# Altium schematic sheet XX_DDR3.SchDoc
size 594 x 420 mm; PageSetup: Record=PageOptions|CenterHorizontal=False|CenterVertical=False|PrintScale=0.95|XCorrection=0.00|YCorrection=0.00|PrintKind=1|BorderSize=5000000|LeftOffset=0|BottomOffset=0|Orientation=1|PaperLength=1000|PaperWidth=1000|Scale=100|PaperSource=15|PrintQuality=600|MediaType=1|DitherType=10|PaperKind=A4|PrintScaleMode=1; ESKD_Decimal_Number: {XXXX.XXXXXX.XXX}; Address1: Address1; Address2: Address2; Address3: Address3; Address4: Address4; DocumentNumber: АБВГ.123456.001 Э3; SheetNumber: 2; SheetTotal: 5; Scale: 1:1; DocumentType: Схема электрическая принципиальная; FirstReferrence: АБВГ.123456.001
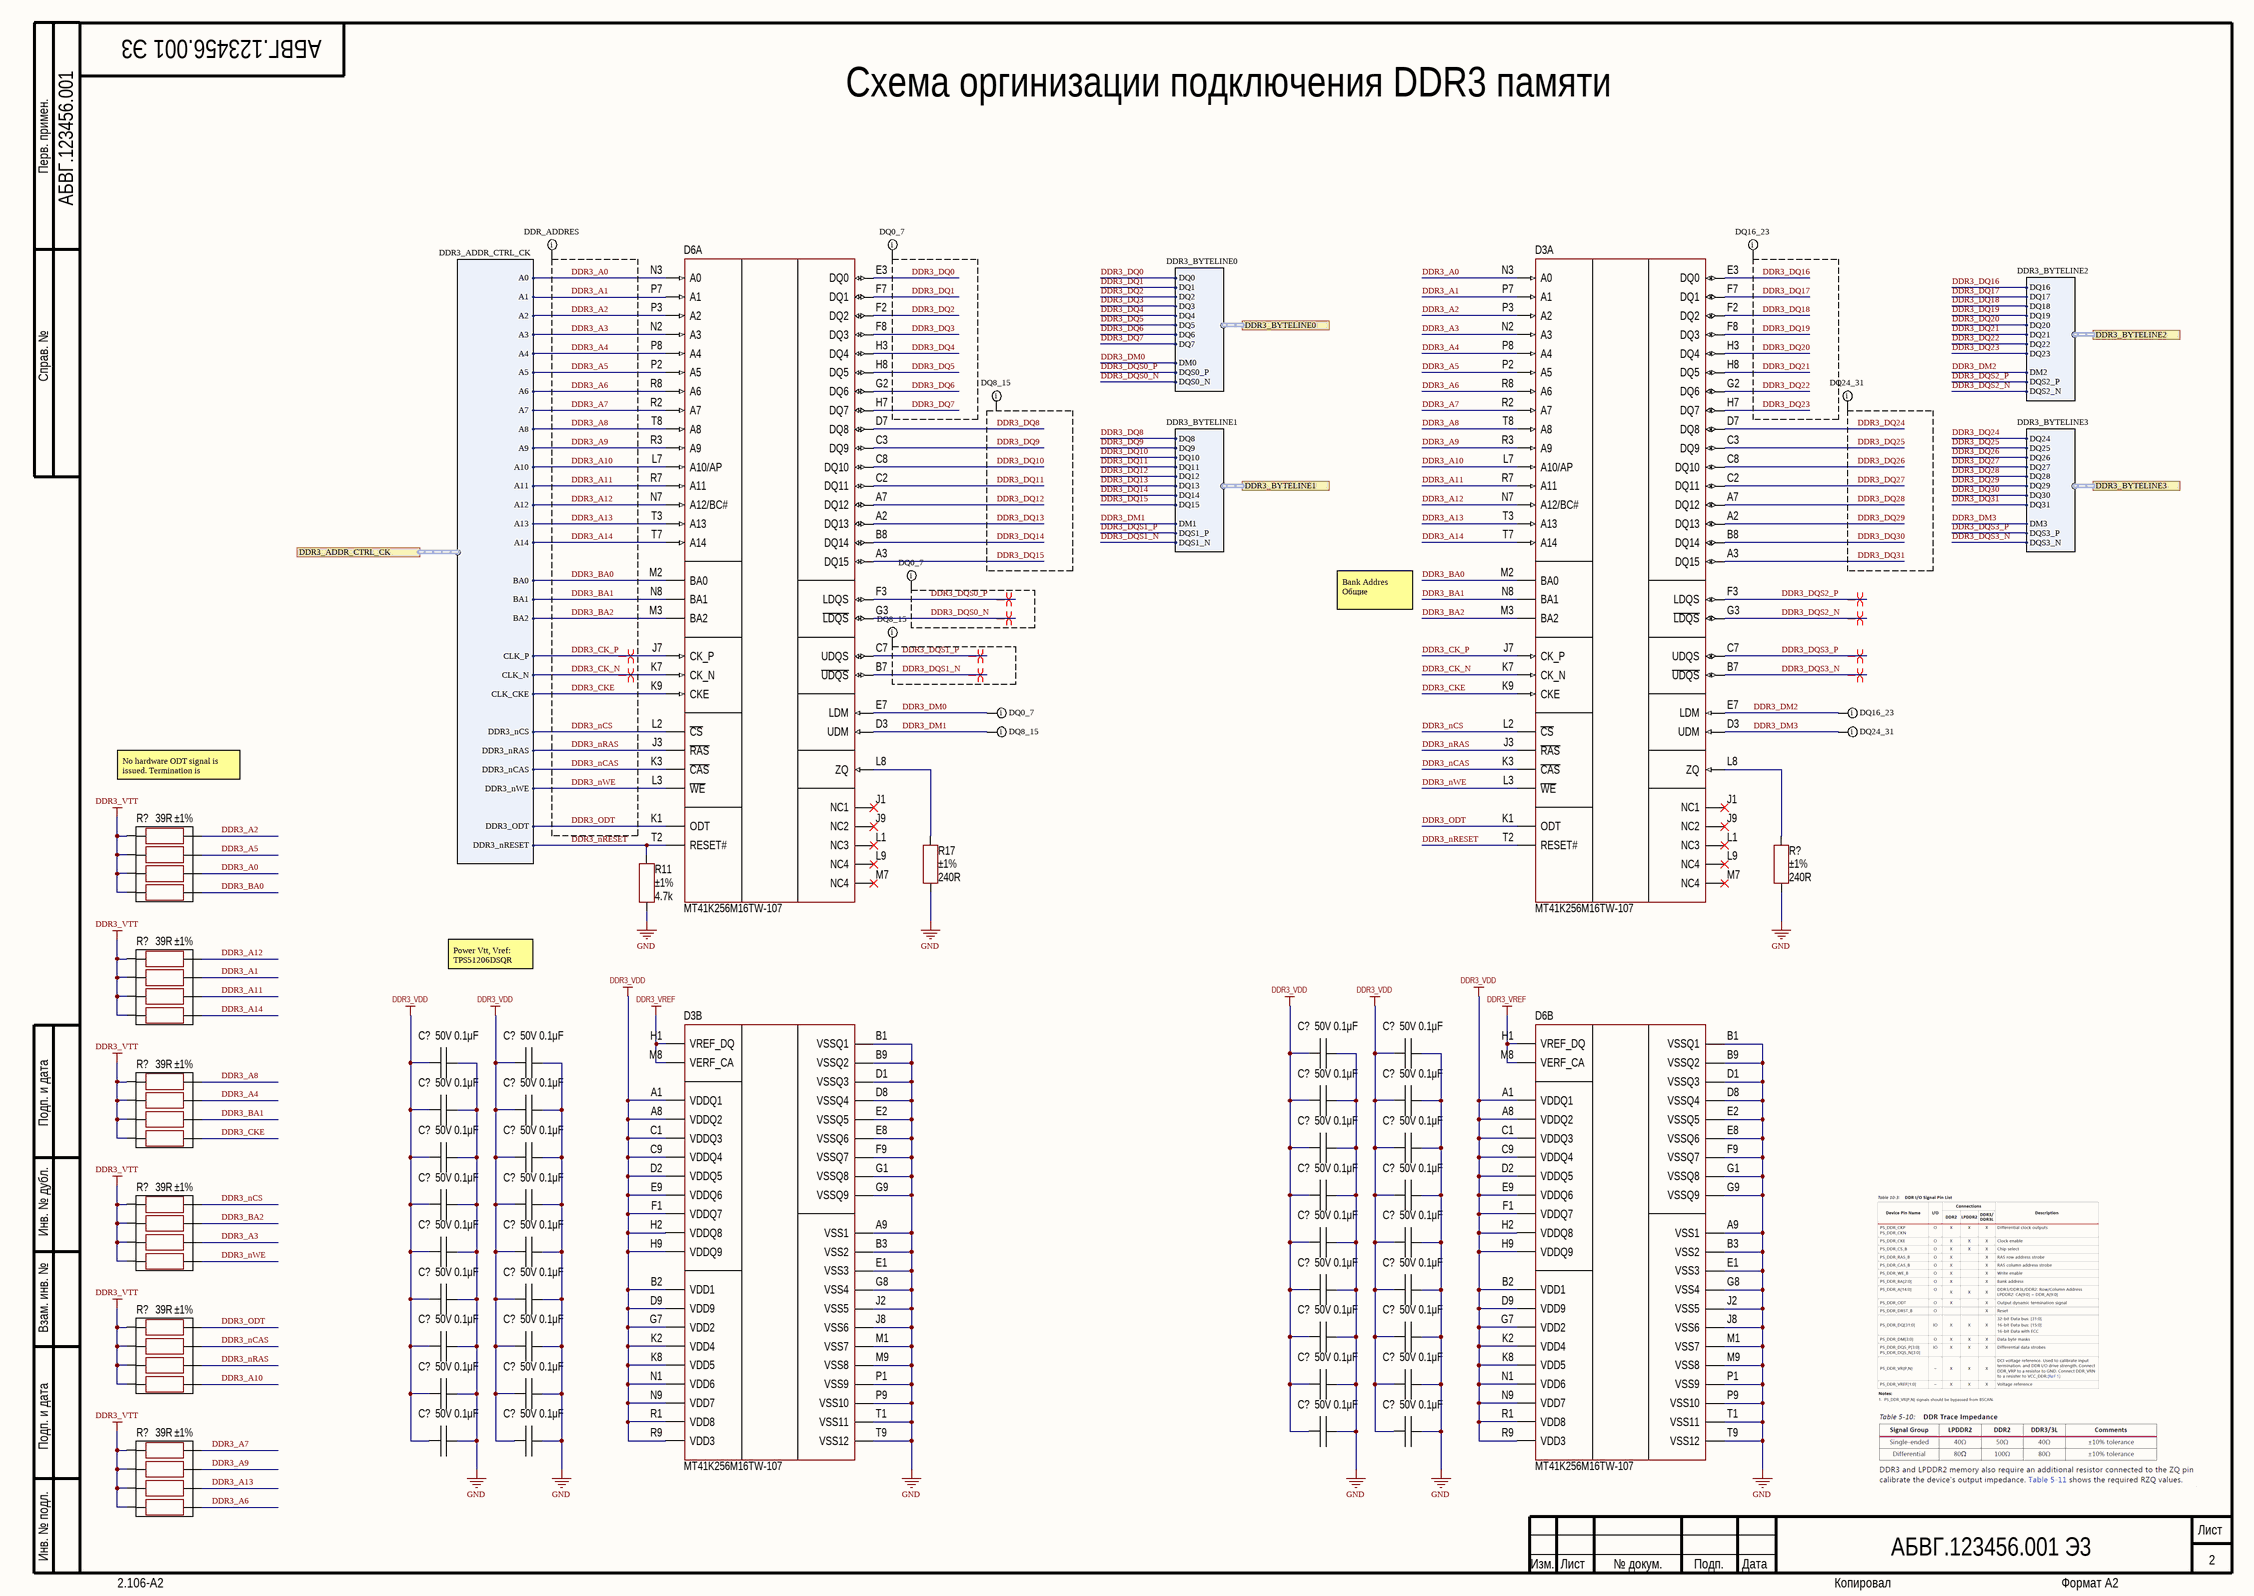
[diagram p0: XX_DDR3.SchDoc]

## Parts
(Parts that share a designator on the sheet are numbered #1, #2 ... from top to bottom, then left to right.)
C?#1  value 0.1μF  Voltage: 50V  [CAP: 0402]
C?#2  value 0.1μF  Voltage: 50V  [CAP: 0402]
C?#3  value 0.1μF  Voltage: 50V  [CAP: 0402]
C?#4  value 0.1μF  Voltage: 50V  [CAP: 0402]
C?#5  value 0.1μF  Voltage: 50V  [CAP: 0402]
C?#6  value 0.1μF  Voltage: 50V  [CAP: 0402]
C?#7  value 0.1μF  Voltage: 50V  [CAP: 0402]
C?#8  value 0.1μF  Voltage: 50V  [CAP: 0402]
C?#9  value 0.1μF  Voltage: 50V  [CAP: 0402]
C?#10  value 0.1μF  Voltage: 50V  [CAP: 0402]
C?#11  value 0.1μF  Voltage: 50V  [CAP: 0402]
C?#12  value 0.1μF  Voltage: 50V  [CAP: 0402]
C?#13  value 0.1μF  Voltage: 50V  [CAP: 0402]
C?#14  value 0.1μF  Voltage: 50V  [CAP: 0402]
C?#15  value 0.1μF  Voltage: 50V  [CAP: 0402]
C?#16  value 0.1μF  Voltage: 50V  [CAP: 0402]
C?#17  value 0.1μF  Voltage: 50V  [CAP: 0402]
C?#18  value 0.1μF  Voltage: 50V  [CAP: 0402]
C?#19  value 0.1μF  Voltage: 50V  [CAP: 0402]
C?#20  value 0.1μF  Voltage: 50V  [CAP: 0402]
C?#21  value 0.1μF  Voltage: 50V  [CAP: 0402]
C?#22  value 0.1μF  Voltage: 50V  [CAP: 0402]
C?#23  value 0.1μF  Voltage: 50V  [CAP: 0402]
C?#24  value 0.1μF  Voltage: 50V  [CAP: 0402]
C?#25  value 0.1μF  Voltage: 50V  [CAP: 0402]
C?#26  value 0.1μF  Voltage: 50V  [CAP: 0402]
C?#27  value 0.1μF  Voltage: 50V  [CAP: 0402]
C?#28  value 0.1μF  Voltage: 50V  [CAP: 0402]
C?#29  value 0.1μF  Voltage: 50V  [CAP: 0402]
C?#30  value 0.1μF  Voltage: 50V  [CAP: 0402]
C?#31  value 0.1μF  Voltage: 50V  [CAP: 0402]
C?#32  value 0.1μF  Voltage: 50V  [CAP: 0402]
C?#33  value 0.1μF  Voltage: 50V  [CAP: 0402]
C?#34  value 0.1μF  Voltage: 50V  [CAP: 0402]
C?#35  value 0.1μF  Voltage: 50V  [CAP: 0402]
C?#36  value 0.1μF  Voltage: 50V  [CAP: 0402]
D3  (no value)  [IC: FBGA96]  (parts A,B of 2)
D6  (no value)  [IC: FBGA96]  (parts A,B of 2)
R11  value 4.7k  Tolerance: ±1%  [RES: 0402]
R17  value 240R  Tolerance: ±1%  [RES: 0402]
R?#1  value 39R  Tolerance: ±1%
R?#2  value 240R  Tolerance: ±1%  [RES: 0402]
R?#3  value 39R  Tolerance: ±1%
R?#4  value 39R  Tolerance: ±1%
R?#5  value 39R  Tolerance: ±1%
R?#6  value 39R  Tolerance: ±1%
R?#7  value 39R  Tolerance: ±1%

## Ports
DDR3_ADDR_CTRL_CK (harness DDR3_ADDR_CTRL_CK), DDR3_BYTELINE0 (harness DDR3_BYTELINE0), DDR3_BYTELINE1 (harness DDR3_BYTELINE1), DDR3_BYTELINE2 (harness DDR3_BYTELINE2), DDR3_BYTELINE3 (harness DDR3_BYTELINE3)

## Harnesses
DDR3_BYTELINE0: DQ0, DQ1, DQ2, DQ3, DQ4, DQ5, DQ6, DQ7, DM0, DQS0_P, DQS0_N
DDR3_BYTELINE1: DQ8, DQ9, DQ10, DQ11, DQ12, DQ13, DQ14, DQ15, DM1, DQS1_P, DQS1_N
DDR3_BYTELINE2: DQ16, DQ17, DQ18, DQ19, DQ20, DQ21, DQ22, DQ23, DM2, DQS2_P, DQS2_N
DDR3_BYTELINE3: DQ24, DQ25, DQ26, DQ27, DQ28, DQ29, DQ30, DQ31, DM3, DQS3_P, DQS3_N
DDR3_ADDR_CTRL_CK: A0, A1, A2, A3, A4, A5, A6, A7, A8, A9, A10, A11, A12, A13, A14, BA0, BA1, BA2, CLK_P, CLK_N, CLK_CKE, DDR3_nCS, DDR3_nRAS, DDR3_nWE, DDR3_nCAS, DDR3_ODT, DDR3_nRESET

## Nets
DDR3_VDD: C?#1.2 C?#2.2 C?#3.2 C?#4.2 C?#5.2 C?#6.2 C?#7.2 C?#8.2 C?#9.2 C?#10.2 C?#11.2 C?#12.2 C?#13.2 C?#14.2 C?#15.2 C?#16.2 C?#17.2 C?#18.2 C?#19.2 C?#20.2 C?#21.2 C?#22.2 C?#23.2 C?#24.2 C?#25.2 C?#26.2 C?#27.2 C?#28.2 C?#29.2 C?#30.2 C?#31.2 C?#32.2 C?#33.2 C?#34.2 C?#35.2 C?#36.2 D3.A1(VDDQ1) D3.A8(VDDQ2) D3.B2(VDD1) D3.C1(VDDQ3) D3.C9(VDDQ4) D3.D2(VDDQ5) D3.D9(VDD9) D3.E9(VDDQ6) D3.F1(VDDQ7) D3.G7(VDD2) D3.H2(VDDQ8) D3.H9(VDDQ9) D3.K2(VDD4) D3.K8(VDD5) D3.N1(VDD6) D3.N9(VDD7) D3.R1(VDD8) D3.R9(VDD3) D6.A1(VDDQ1) D6.A8(VDDQ2) D6.B2(VDD1) D6.C1(VDDQ3) D6.C9(VDDQ4) D6.D2(VDDQ5) D6.D9(VDD9) D6.E9(VDDQ6) D6.F1(VDDQ7) D6.G7(VDD2) D6.H2(VDDQ8) D6.H9(VDDQ9) D6.K2(VDD4) D6.K8(VDD5) D6.N1(VDD6) D6.N9(VDD7) D6.R1(VDD8) D6.R9(VDD3)
DDR3_VREF: D3.H1(VREF_DQ) D3.M8(VERF_CA) D6.H1(VREF_DQ) D6.M8(VERF_CA)
DDR3_VTT: R?#1.1 R?#1.3 R?#1.5 R?#1.7 R?#3.1 R?#3.3 R?#3.5 R?#3.7 R?#4.1 R?#4.3 R?#4.5 R?#4.7 R?#5.1 R?#5.3 R?#5.5 R?#5.7 R?#6.1 R?#6.3 R?#6.5 R?#6.7 R?#7.1 R?#7.3 R?#7.5 R?#7.7
GND: C?#1.1 C?#2.1 C?#3.1 C?#4.1 C?#5.1 C?#6.1 C?#7.1 C?#8.1 C?#9.1 C?#10.1 C?#11.1 C?#12.1 C?#13.1 C?#14.1 C?#15.1 C?#16.1 C?#17.1 C?#18.1 C?#19.1 C?#20.1 C?#21.1 C?#22.1 C?#23.1 C?#24.1 C?#25.1 C?#26.1 C?#27.1 C?#28.1 C?#29.1 C?#30.1 C?#31.1 C?#32.1 C?#33.1 C?#34.1 C?#35.1 C?#36.1 D3.A9(VSS1) D3.B1(VSSQ1) D3.B3(VSS2) D3.B9(VSSQ2) D3.D1(VSSQ3) D3.D8(VSSQ4) D3.E1(VSS3) D3.E2(VSSQ5) D3.E8(VSSQ6) D3.F9(VSSQ7) D3.G1(VSSQ8) D3.G8(VSS4) D3.G9(VSSQ9) D3.J2(VSS5) D3.J8(VSS6) D3.M1(VSS7) D3.M9(VSS8) D3.P1(VSS9) D3.P9(VSS10) D3.T1(VSS11) D3.T9(VSS12) D6.A9(VSS1) D6.B1(VSSQ1) D6.B3(VSS2) D6.B9(VSSQ2) D6.D1(VSSQ3) D6.D8(VSSQ4) D6.E1(VSS3) D6.E2(VSSQ5) D6.E8(VSSQ6) D6.F9(VSSQ7) D6.G1(VSSQ8) D6.G8(VSS4) D6.G9(VSSQ9) D6.J2(VSS5) D6.J8(VSS6) D6.M1(VSS7) D6.M9(VSS8) D6.P1(VSS9) D6.P9(VSS10) D6.T1(VSS11) D6.T9(VSS12) R11.2 R17.2 R?#2.2
DDR3_A0: D3.N3(A0) D6.N3(A0) R?#1.6 ; port DDR3_ADDR_CTRL_CK.A0
DDR3_A1: D3.P7(A1) D6.P7(A1) R?#3.4 ; port DDR3_ADDR_CTRL_CK.A1
DDR3_A2: D3.P3(A2) D6.P3(A2) R?#1.2 ; port DDR3_ADDR_CTRL_CK.A2
DDR3_A3: D3.N2(A3) D6.N2(A3) R?#5.6 ; port DDR3_ADDR_CTRL_CK.A3
DDR3_A4: D3.P8(A4) D6.P8(A4) R?#4.4 ; port DDR3_ADDR_CTRL_CK.A4
DDR3_A5: D3.P2(A5) D6.P2(A5) R?#1.4 ; port DDR3_ADDR_CTRL_CK.A5
DDR3_A6: D3.R8(A6) D6.R8(A6) R?#7.8 ; port DDR3_ADDR_CTRL_CK.A6
DDR3_A7: D3.R2(A7) D6.R2(A7) R?#7.2 ; port DDR3_ADDR_CTRL_CK.A7
DDR3_A8: D3.T8(A8) D6.T8(A8) R?#4.2 ; port DDR3_ADDR_CTRL_CK.A8
DDR3_A9: D3.R3(A9) D6.R3(A9) R?#7.4 ; port DDR3_ADDR_CTRL_CK.A9
DDR3_A10: D3.L7(A10/AP) D6.L7(A10/AP) R?#6.8 ; port DDR3_ADDR_CTRL_CK.A10
DDR3_A11: D3.R7(A11) D6.R7(A11) R?#3.6 ; port DDR3_ADDR_CTRL_CK.A11
DDR3_A12: D3.N7(A12/BC#) D6.N7(A12/BC#) R?#3.2 ; port DDR3_ADDR_CTRL_CK.A12
DDR3_A13: D3.T3(A13) D6.T3(A13) R?#7.6 ; port DDR3_ADDR_CTRL_CK.A13
DDR3_A14: D3.T7(A14) D6.T7(A14) R?#3.8 ; port DDR3_ADDR_CTRL_CK.A14
DDR3_BA0: D3.M2(BA0) D6.M2(BA0) R?#1.8 ; port DDR3_ADDR_CTRL_CK.BA0
DDR3_BA1: D3.N8(BA1) D6.N8(BA1) R?#4.6 ; port DDR3_ADDR_CTRL_CK.BA1
DDR3_BA2: D3.M3(BA2) D6.M3(BA2) R?#5.4 ; port DDR3_ADDR_CTRL_CK.BA2
DDR3_CK_N: D3.K7(CK_N) D6.K7(CK_N) ; port DDR3_ADDR_CTRL_CK.CLK_N
DDR3_CK_P: D3.J7(CK_P) D6.J7(CK_P) ; port DDR3_ADDR_CTRL_CK.CLK_P
DDR3_CKE: D3.K9(CKE) D6.K9(CKE) R?#4.8 ; port DDR3_ADDR_CTRL_CK.CLK_CKE
DDR3_DM0: D6.E7(LDM) ; port DDR3_BYTELINE0.DM0
DDR3_DM1: D6.D3(UDM) ; port DDR3_BYTELINE1.DM1
DDR3_DM2: D3.E7(LDM) ; port DDR3_BYTELINE2.DM2
DDR3_DM3: D3.D3(UDM) ; port DDR3_BYTELINE3.DM3
DDR3_DQ0: D6.E3(DQ0) ; port DDR3_BYTELINE0.DQ0
DDR3_DQ1: D6.F7(DQ1) ; port DDR3_BYTELINE0.DQ1
DDR3_DQ2: D6.F2(DQ2) ; port DDR3_BYTELINE0.DQ2
DDR3_DQ3: D6.F8(DQ3) ; port DDR3_BYTELINE0.DQ3
DDR3_DQ4: D6.H3(DQ4) ; port DDR3_BYTELINE0.DQ4
DDR3_DQ5: D6.H8(DQ5) ; port DDR3_BYTELINE0.DQ5
DDR3_DQ6: D6.G2(DQ6) ; port DDR3_BYTELINE0.DQ6
DDR3_DQ7: D6.H7(DQ7) ; port DDR3_BYTELINE0.DQ7
DDR3_DQ8: D6.D7(DQ8) ; port DDR3_BYTELINE1.DQ8
DDR3_DQ9: D6.C3(DQ9) ; port DDR3_BYTELINE1.DQ9
DDR3_DQ10: D6.C8(DQ10) ; port DDR3_BYTELINE1.DQ10
DDR3_DQ11: D6.C2(DQ11) ; port DDR3_BYTELINE1.DQ11
DDR3_DQ12: D6.A7(DQ12) ; port DDR3_BYTELINE1.DQ12
DDR3_DQ13: D6.A2(DQ13) ; port DDR3_BYTELINE1.DQ13
DDR3_DQ14: D6.B8(DQ14) ; port DDR3_BYTELINE1.DQ14
DDR3_DQ15: D6.A3(DQ15) ; port DDR3_BYTELINE1.DQ15
DDR3_DQ16: D3.E3(DQ0) ; port DDR3_BYTELINE2.DQ16
DDR3_DQ17: D3.F7(DQ1) ; port DDR3_BYTELINE2.DQ17
DDR3_DQ18: D3.F2(DQ2) ; port DDR3_BYTELINE2.DQ18
DDR3_DQ19: D3.F8(DQ3) ; port DDR3_BYTELINE2.DQ19
DDR3_DQ20: D3.H3(DQ4) ; port DDR3_BYTELINE2.DQ20
DDR3_DQ21: D3.H8(DQ5) ; port DDR3_BYTELINE2.DQ21
DDR3_DQ22: D3.G2(DQ6) ; port DDR3_BYTELINE2.DQ22
DDR3_DQ23: D3.H7(DQ7) ; port DDR3_BYTELINE2.DQ23
DDR3_DQ24: D3.D7(DQ8) ; port DDR3_BYTELINE3.DQ24
DDR3_DQ25: D3.C3(DQ9) ; port DDR3_BYTELINE3.DQ25
DDR3_DQ26: D3.C8(DQ10) ; port DDR3_BYTELINE3.DQ26
DDR3_DQ27: D3.C2(DQ11) ; port DDR3_BYTELINE3.DQ27
DDR3_DQ28: D3.A7(DQ12) ; port DDR3_BYTELINE3.DQ28
DDR3_DQ29: D3.A2(DQ13) ; port DDR3_BYTELINE3.DQ29
DDR3_DQ30: D3.B8(DQ14) ; port DDR3_BYTELINE3.DQ30
DDR3_DQ31: D3.A3(DQ15) ; port DDR3_BYTELINE3.DQ31
DDR3_DQS0_N: D6.G3(~{LDQS}) ; port DDR3_BYTELINE0.DQS0_N
DDR3_DQS0_P: D6.F3(LDQS) ; port DDR3_BYTELINE0.DQS0_P
DDR3_DQS1_N: D6.B7(~{UDQS}) ; port DDR3_BYTELINE1.DQS1_N
DDR3_DQS1_P: D6.C7(UDQS) ; port DDR3_BYTELINE1.DQS1_P
DDR3_DQS2_N: D3.G3(~{LDQS}) ; port DDR3_BYTELINE2.DQS2_N
DDR3_DQS2_P: D3.F3(LDQS) ; port DDR3_BYTELINE2.DQS2_P
DDR3_DQS3_N: D3.B7(~{UDQS}) ; port DDR3_BYTELINE3.DQS3_N
DDR3_DQS3_P: D3.C7(UDQS) ; port DDR3_BYTELINE3.DQS3_P
DDR3_nCAS: D3.K3(~{CAS}) D6.K3(~{CAS}) R?#6.4 ; port DDR3_ADDR_CTRL_CK.DDR3_nCAS
DDR3_nCS: D3.L2(~{CS}) D6.L2(~{CS}) R?#5.2 ; port DDR3_ADDR_CTRL_CK.DDR3_nCS
DDR3_nRAS: D3.J3(~{RAS}) D6.J3(~{RAS}) R?#6.6 ; port DDR3_ADDR_CTRL_CK.DDR3_nRAS
DDR3_nRESET: D3.T2(RESET#) D6.T2(RESET#) R11.1 ; port DDR3_ADDR_CTRL_CK.DDR3_nRESET
DDR3_nWE: D3.L3(~{WE}) D6.L3(~{WE}) R?#5.8 ; port DDR3_ADDR_CTRL_CK.DDR3_nWE
DDR3_ODT: D3.K1(ODT) D6.K1(ODT) R?#6.2 ; port DDR3_ADDR_CTRL_CK.DDR3_ODT
NetD3_L8: D3.L8(ZQ) R?#2.1
NetD6_L8: D6.L8(ZQ) R17.1

Not connected (* = marked no-connect by the designer): D3 J1(NC1)* J9(NC2)* L1(NC3)* L9(NC4)* M7(NC4)*; D6 J1(NC1)* J9(NC2)* L1(NC3)* L9(NC4)* M7(NC4)*

## Layout directives
differential pair: DDR3_CK_N, DDR3_CK_P, DDR3_DQS0_N, DDR3_DQS0_P, DDR3_DQS1_N, DDR3_DQS1_P, DDR3_DQS2_N, DDR3_DQS2_P, DDR3_DQS3_N, DDR3_DQS3_P
net class DDR_ADDRES: DDR3_A0, DDR3_A1, DDR3_A2, DDR3_A3, DDR3_A4, DDR3_A5, DDR3_A6, DDR3_A7, DDR3_A8, DDR3_A9, DDR3_A10, DDR3_A11, DDR3_A12, DDR3_A13, DDR3_A14, DDR3_BA0, DDR3_BA1, DDR3_BA2, DDR3_CK_N, DDR3_CK_P, DDR3_CKE, DDR3_nCAS, DDR3_nCS, DDR3_nRAS, DDR3_nWE, DDR3_ODT
net class DQ0_7: DDR3_DM0, DDR3_DQ0, DDR3_DQ1, DDR3_DQ2, DDR3_DQ3, DDR3_DQ4, DDR3_DQ5, DDR3_DQ6, DDR3_DQ7, DDR3_DQS0_N, DDR3_DQS0_P
net class DQ8_15: DDR3_DM1, DDR3_DQ8, DDR3_DQ9, DDR3_DQ10, DDR3_DQ11, DDR3_DQ12, DDR3_DQ13, DDR3_DQ14, DDR3_DQ15, DDR3_DQS1_N, DDR3_DQS1_P
net class DQ16_23: DDR3_DM2, DDR3_DQ16, DDR3_DQ17, DDR3_DQ18, DDR3_DQ19, DDR3_DQ20, DDR3_DQ21, DDR3_DQ22, DDR3_DQ23
net class DQ24_31: DDR3_DM3, DDR3_DQ24, DDR3_DQ25, DDR3_DQ26, DDR3_DQ27, DDR3_DQ28, DDR3_DQ29, DDR3_DQ30, DDR3_DQ31

## Notes on the sheet
- Схема оргинизации подключения DDR3 памяти
- Bank Addres
  Общие
- No hardware ODT signal is issued. Termination is command base
- Power Vtt, Vref:
  TPS51206DSQR
- Перв. примен.
- Справ. №
- Подп. и дата
- Инв. № дубл.
- Взам. инв. №
- Инв. № подл.
- Изм.
- Лист
- № докум.
- Подп.
- Дата
- 2.106-A2
- Копировал
- Формат А2

## Library data of the parts
C?#1-C?#36 = Ceramic_0402: Manufacturer: Murata Electronics; PartNumber: GRM155R71H104KE14D; ValueManufacturerPartNumber: Ceramic capacitor, 0.1μF, X7R, ±10%, 50V, 0402, -55...+125°C; TypeCapacitor: Ceramic capacitor; Tolerance: ±10%; TypeDielectric: X7R; Package: 0402; HelpURL: https://www.lcsc.com/product-detail/Multilayer-Ceramic-Capacitors-MLCC-SMD-SMT_Murata-Electronics-GRM155R71H104KE14D_C77020.html; Temperature: -55...+125°C
D3 D6 = MT41K256M16TW-107: DDR3L SDRAM; Manufacturer: Micron Tech; ValueManufacturerPartNumber: DDR3L SDRAM, DDR3, 128Mb (8M x 16), 166 MHz, Parallel, 3...3.6V, 0...+70°C, FBGA-96; Supply: 3...3.6V; Speed: 166 MHz; InterfaceData: Parallel; MemorySize: 128Mb (8M x 16); MemoryType: DDR3; HelpURL: https://www.lcsc.com/product-detail/DDR-SDRAM_Micron-Tech-MT41K256M16TW-107-IT-P_C367428.html; Package: FBGA-96; ComponentType: DDR3L SDRAM; Temperature: 0...+70°C; PartNumber: MT41K256M16TW-107
R11 = Resistor_0402: Manufacturer: Yageo; PartNumber: RC0402FR-074K7L; ValueManufacturerPartNumber: Resistor film, 4.7k, ±1%, 0402, 0.063W, -55...+125°C; TypeResistor: Resistor film; Power: 0.063W; Package: 0402; HelpURL: https://www.lcsc.com/product-detail/Chip-Resistor-Surface-Mount_YAGEO-RC0402FR-074K7L_C105871.html; Temperature: -55...+125°C
R17 R?#2 = Resistor_0603: Manufacturer: Yageo; PartNumber: RC0603JR-07100RL; ValueManufacturerPartNumber: Resistor film, 240R, ±1%, 0603, 0.1W, -55...+125°C; TypeResistor: Resistor film; Power: 0.1W; Package: 0603; HelpURL: https://www.digikey.com/product-detail/en/yageo/RC0603JR-07100RL/311-100GRCT-ND/729644; Temperature: -55...+125°C
R?#1 R?#3-R?#7 = Resistor_0402_Array: Manufacturer: Yageo; PartNumber: YC164-FR-0739RL; ValueManufacturerPartNumber: Resistor film, 39R, ±1%, 0402x4, 0.063W, -55...+125°C; TypeResistor: Resistor film; Power: 0.063W; Package: 0402x4; HelpURL: https://www.lcsc.com/product-detail/Resistor-Networks-Arrays_YAGEO-YC164-FR-0739RL_C309682.html; Temperature: -55...+125°C